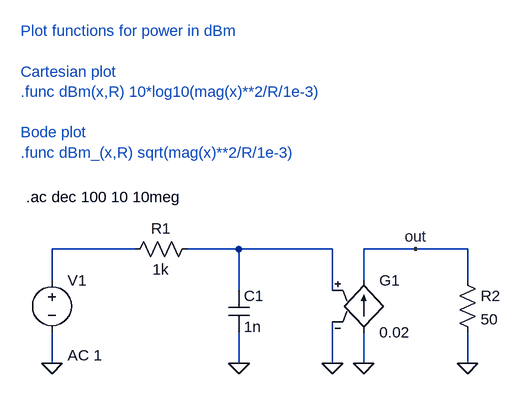
[diagram p0: schematic ac_math1.asc]
ac_math1.asc, the LTspice schematic file:
Version 4
SHEET 1 880 680
WIRE 128 160 0 160
WIRE 288 160 208 160
WIRE 432 160 288 160
WIRE 560 160 480 160
WIRE 640 160 560 160
WIRE 0 208 0 160
WIRE 480 208 480 160
WIRE 640 208 640 160
WIRE 288 224 288 160
WIRE 432 224 432 160
WIRE 0 336 0 288
WIRE 288 336 288 288
WIRE 432 336 432 272
WIRE 480 336 480 288
WIRE 640 336 640 288
FLAG 0 336 0
FLAG 288 336 0
FLAG 432 336 0
FLAG 480 336 0
FLAG 640 336 0
FLAG 560 160 out
SYMBOL res 112 176 R270
WINDOW 0 32 56 VTop 0
WINDOW 3 0 56 VBottom 0
SYMATTR InstName R1
SYMATTR Value 1k
SYMBOL cap 272 224 R0
SYMATTR InstName C1
SYMATTR Value 1n
SYMBOL voltage 0 192 R0
WINDOW 123 24 132 Left 0
WINDOW 39 0 0 Left 0
SYMATTR Value2 AC 1
SYMATTR InstName V1
SYMATTR Value ""
SYMBOL res 624 192 R0
SYMATTR InstName R2
SYMATTR Value 50
SYMBOL g 480 192 R0
SYMATTR InstName G1
SYMATTR Value 0.02
TEXT -40 80 Left 0 !.ac dec 100 10 10meg
TEXT -48 -176 Left 0 ;Plot functions for power in dBm\n \nCartesian plot\n.func dBm(x,R) 10*log10(mag(x)**2/R/1e-3)\n \nBode plot\n.func dBm_(x,R) sqrt(mag(x)**2/R/1e-3)

The netlist it stands for:
* ac_math1.asc
R1 N001 N002 1k
C1 N002 0 1n
V1 N001 0 AC 1
R2 out 0 50
G1 0 out N002 0 0.02
.ac dec 100 10 10meg
* Plot functions for power in dBm
* Cartesian plot
* .func dBm(x,R) 10*log10(mag(x)**2/R/1e-3)
* Bode plot
* .func dBm_(x,R) sqrt(mag(x)**2/R/1e-3)
.backanno
.end